# EasyEDA schematic BikeLightsESP32.json
TITLE: Sheet_1; REV: 1.0; Date: 2022-03-12; Sheet: 1/1; Company: Your Company
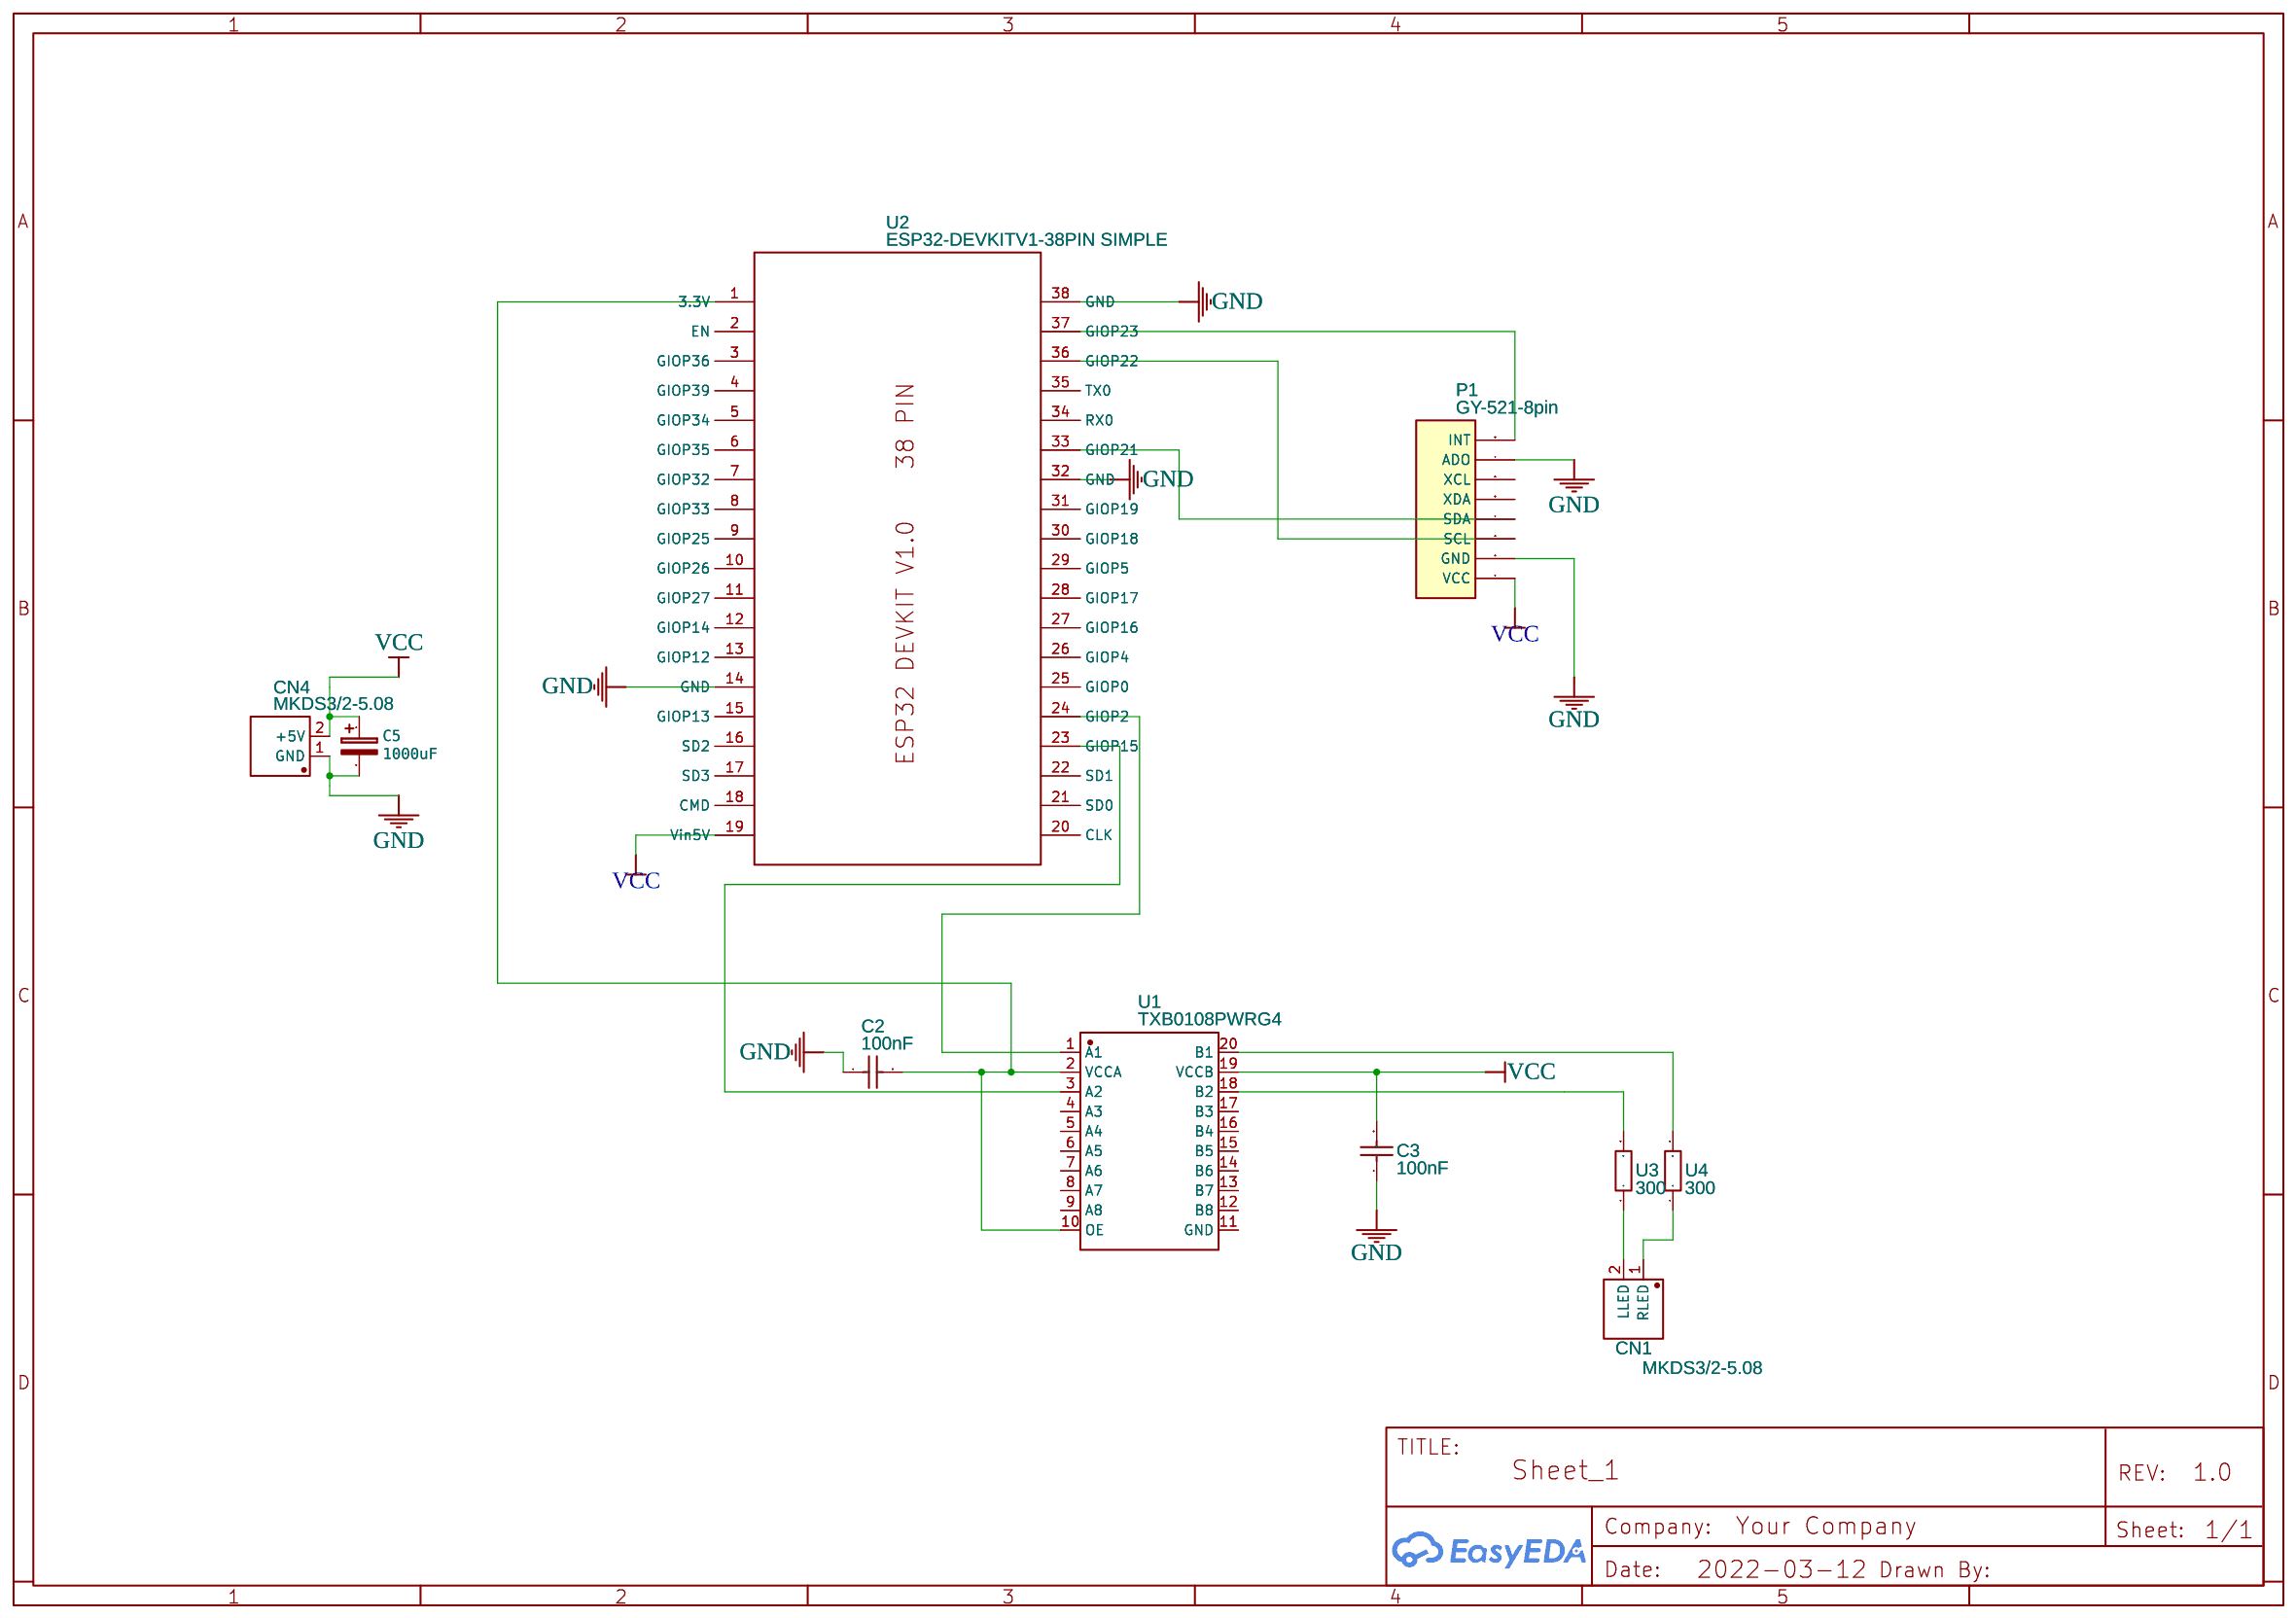
[diagram p0: schematic sheet]

## Parts
C2  100nF  [C0805]
C3  100nF  [C0805]
C5  1000uF  [CP_RADIAL_D8.0MM_P3.50MM]
CN1  MKDS3/2-5.08  [CONN-TH_MKDS3-2-5.08]
CN4  MKDS3/2-5.08  [CONN-TH_MKDS3-2-5.08]
P1  GY-521-8pin  [GY-521-8PIN]
U1  TXB0108PWRG4  [TSSOP-20_L6.5-W4.4-P0.65-LS6.4-BL]
U2  ESP32-DEVKITV1-38PIN SIMPLE  [ESP32-DEVKIT-V1.0-38PIN-PCB]
U3  300  [R0805]
U4  300  [R0805]

## Library data of the parts
C2 C3 = 0805F104M500: Supplier: LCSC; Manufacturer: WTC; Contributor: LCSC; Supplier Part: C95395; JLCPCB Part Class: Extended Part
CN1 CN4 = MKDS3/2-5.08: Supplier: LCSC; Manufacturer: Phoenix Contact; Supplier Part: C89120; JLCPCB Part Class: Extended Part
P1 = GY-521-8pin
U1 = TXB0108PWRG4: Supplier: LCSC; Supplier Part: C2677607; Manufacturer: TI(德州仪器); Contributor: LCSC
U2 = ESP32-DEVKITV1-38PIN SIMPLE: Manufacturer: espressif; Manufacturer Part: ESP-WROOM-32; Supplier: Aliexpress; link: https://docs.espressif.com/projects/esp-idf/en/latest/esp32/hw-reference/esp32/get-started-devkitc.html; Contributor: TheLapin
U3 U4 = HPCR0805F300RK9: Supplier: LCSC; Supplier Part: C365284; Manufacturer: ResistorToday; Contributor: LCSC

## Nets
GND: C2.1 C3.1 C5.2 CN4.1(GND) P1.2(GND) P1.7(ADO) U2.14(GND) U2.32(GND) U2.38(GND)
VCC: C3.2 C5.1 CN4.2(+5V) P1.1(VCC) U1.19(VCCB) U2.19(Vin5V)
Net-(C2-2): C2.2 U1.2(VCCA) U1.10(OE) U2.1(3.3V)
Net-(CN1-1): CN1.1(RLED) U4.1
Net-(CN1-2): CN1.2(LLED) U3.1
Net-(P1-3): P1.3(SCL) U2.36(GIOP22)
Net-(P1-4): P1.4(SDA) U2.33(GIOP21)
Net-(P1-8): P1.8(INT) U2.37(GIOP23)
Net-(U1-1): U1.1(A1) U2.24(GIOP2)
Net-(U1-3): U1.3(A2) U2.23(GIOP15)
Net-(U1-18): U1.18(B2) U3.2
Net-(U1-20): U1.20(B1) U4.2

Not connected (* = marked no-connect by the designer): P1 5(XDA) 6(XCL); U1 4(A3) 5(A4) 6(A5) 7(A6) 8(A7) 9(A8) 11(GND) 12(B8) 13(B7) 14(B6) 15(B5) 16(B4) 17(B3); U2 2(EN) 3(GIOP36) 4(GIOP39) 5(GIOP34) 6(GIOP35) 7(GIOP32) 8(GIOP33) 9(GIOP25) 10(GIOP26) 11(GIOP27) 12(GIOP14) 13(GIOP12) 15(GIOP13) 16(SD2) 17(SD3) 18(CMD) 20(CLK) 21(SD0) 22(SD1) 25(GIOP0) 26(GIOP4) 27(GIOP16) 28(GIOP17) 29(GIOP5) 30(GIOP18) 31(GIOP19) 34(RX0) 35(TX0)
